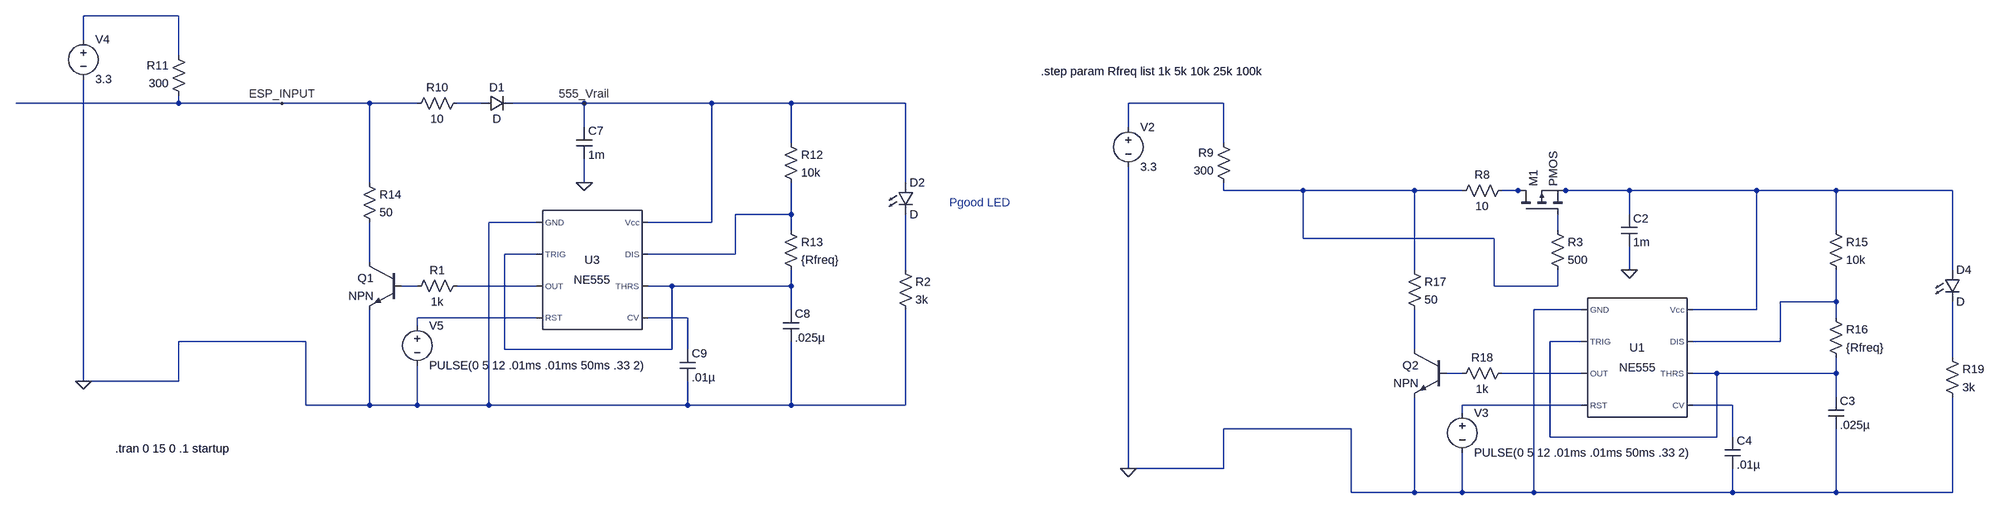
[diagram p0: schematic 2 Wire Communication.asc]
2 Wire Communication.asc, the LTspice schematic file:
Version 4
SHEET 1 3764 680
WIRE -2032 -400 -2224 -400
WIRE -2224 -352 -2224 -400
WIRE -2032 -320 -2032 -400
WIRE -2032 -224 -2032 -240
WIRE -2032 -224 -2608 -224
WIRE -1824 -224 -2032 -224
WIRE -1648 -224 -1824 -224
WIRE -1552 -224 -1648 -224
WIRE -1424 -224 -1472 -224
WIRE -1216 -224 -1360 -224
WIRE -960 -224 -1216 -224
WIRE -800 -224 -960 -224
WIRE -416 -224 -800 -224
WIRE 224 -224 32 -224
WIRE -1216 -176 -1216 -224
WIRE 32 -176 32 -224
WIRE -800 -144 -800 -224
WIRE 224 -144 224 -224
WIRE -1648 -64 -1648 -224
WIRE -1216 -64 -1216 -112
WIRE -416 -64 -416 -224
WIRE 224 -48 224 -64
WIRE 384 -48 224 -48
WIRE 608 -48 384 -48
WIRE 704 -48 608 -48
WIRE 816 -48 784 -48
WIRE 832 -48 816 -48
WIRE 912 -48 896 -48
WIRE 1040 -48 912 -48
WIRE 1296 -48 1040 -48
WIRE 1456 -48 1296 -48
WIRE 1840 -48 1456 -48
WIRE -800 0 -800 -64
WIRE -800 0 -912 0
WIRE 1040 0 1040 -48
WIRE -1312 16 -1408 16
WIRE -960 16 -960 -224
WIRE -960 16 -1088 16
WIRE -800 32 -800 0
WIRE 896 32 896 0
WIRE 1456 32 1456 -48
WIRE 384 48 384 -48
WIRE 768 48 384 48
WIRE -1312 80 -1376 80
WIRE -912 80 -912 0
WIRE -912 80 -1088 80
WIRE -1648 96 -1648 16
WIRE -416 112 -416 0
WIRE 608 112 608 -48
WIRE 1040 112 1040 64
WIRE 1840 112 1840 -48
WIRE -1552 144 -1584 144
WIRE -1312 144 -1472 144
WIRE -1040 144 -1088 144
WIRE -800 144 -800 112
WIRE -800 144 -1040 144
WIRE 768 144 768 48
WIRE 896 144 896 112
WIRE 896 144 768 144
WIRE 1456 176 1456 112
WIRE 1456 176 1344 176
WIRE -800 192 -800 144
WIRE 944 192 848 192
WIRE 1296 192 1296 -48
WIRE 1296 192 1168 192
WIRE -1312 208 -1552 208
WIRE -1008 208 -1088 208
WIRE 1456 208 1456 176
WIRE -1552 224 -1552 208
WIRE -1776 256 -2032 256
WIRE 944 256 880 256
WIRE 1344 256 1344 176
WIRE 1344 256 1168 256
WIRE -1376 272 -1376 80
WIRE -1040 272 -1040 144
WIRE -1040 272 -1376 272
WIRE -1008 272 -1008 208
WIRE 608 272 608 192
WIRE 1840 288 1840 176
WIRE 704 320 672 320
WIRE 944 320 784 320
WIRE 1216 320 1168 320
WIRE 1456 320 1456 288
WIRE 1456 320 1216 320
WIRE -2224 336 -2224 -272
WIRE -2032 336 -2032 256
WIRE -2032 336 -2224 336
WIRE 1456 368 1456 320
WIRE -1776 384 -1776 256
WIRE -1648 384 -1648 192
WIRE -1648 384 -1776 384
WIRE -1552 384 -1552 304
WIRE -1552 384 -1648 384
WIRE -1408 384 -1408 16
WIRE -1408 384 -1552 384
WIRE -1008 384 -1008 336
WIRE -1008 384 -1408 384
WIRE -800 384 -800 256
WIRE -800 384 -1008 384
WIRE -416 384 -416 192
WIRE -416 384 -800 384
WIRE 944 384 704 384
WIRE 1248 384 1168 384
WIRE 704 400 704 384
WIRE 480 432 224 432
WIRE 880 448 880 256
WIRE 1216 448 1216 320
WIRE 1216 448 880 448
WIRE 1248 448 1248 384
WIRE 32 512 32 -96
WIRE 224 512 224 432
WIRE 224 512 32 512
WIRE 480 560 480 432
WIRE 608 560 608 368
WIRE 608 560 480 560
WIRE 704 560 704 480
WIRE 704 560 608 560
WIRE 848 560 848 192
WIRE 848 560 704 560
WIRE 1248 560 1248 512
WIRE 1248 560 848 560
WIRE 1456 560 1456 432
WIRE 1456 560 1248 560
WIRE 1840 560 1840 368
WIRE 1840 560 1456 560
FLAG -2224 336 0
FLAG -1216 -64 0
FLAG -1824 -224 ESP_INPUT
FLAG -1216 -224 555_Vrail
FLAG 32 512 0
FLAG 1040 112 0
SYMBOL Misc\\NE555 -1200 112 R0
SYMATTR InstName U3
SYMBOL cap -1232 -176 R0
SYMATTR InstName C7
SYMATTR Value 1m
SYMBOL res -1456 -240 R90
WINDOW 0 0 56 VBottom 2
WINDOW 3 32 56 VTop 2
SYMATTR InstName R10
SYMATTR Value 10
SYMBOL res -2016 -224 R180
WINDOW 0 36 76 Left 2
WINDOW 3 36 40 Left 2
SYMATTR InstName R11
SYMATTR Value 300
SYMBOL voltage -2224 -368 R0
WINDOW 123 0 0 Left 0
WINDOW 39 0 0 Left 0
SYMATTR InstName V4
SYMATTR Value 3.3
SYMBOL res -816 -160 R0
SYMATTR InstName R12
SYMATTR Value 10k
SYMBOL cap -816 192 R0
SYMATTR InstName C8
SYMATTR Value .025µ
SYMBOL cap -1024 272 R0
SYMATTR InstName C9
SYMATTR Value .01µ
SYMBOL res -816 16 R0
SYMATTR InstName R13
SYMATTR Value {Rfreq}
SYMBOL res -1664 -80 R0
SYMATTR InstName R14
SYMATTR Value 50
SYMBOL voltage -1552 208 R0
WINDOW 123 0 0 Left 0
WINDOW 39 0 0 Left 0
SYMATTR InstName V5
SYMATTR Value PULSE(0 5 12 .01ms .01ms 50ms .33 2)
SYMBOL npn -1584 96 M0
SYMATTR InstName Q1
SYMBOL diode -1424 -208 R270
WINDOW 0 32 32 VTop 2
WINDOW 3 0 32 VBottom 2
SYMATTR InstName D1
SYMBOL res -1456 128 R90
WINDOW 0 0 56 VBottom 2
WINDOW 3 32 56 VTop 2
SYMATTR InstName R1
SYMATTR Value 1k
SYMBOL LED -432 -64 R0
SYMATTR InstName D2
SYMBOL res -432 96 R0
SYMATTR InstName R2
SYMATTR Value 3k
SYMBOL Misc\\NE555 1056 288 R0
SYMATTR InstName U1
SYMBOL cap 1024 0 R0
SYMATTR InstName C2
SYMATTR Value 1m
SYMBOL res 800 -64 R90
WINDOW 0 0 56 VBottom 2
WINDOW 3 32 56 VTop 2
SYMATTR InstName R8
SYMATTR Value 10
SYMBOL res 240 -48 R180
WINDOW 0 36 76 Left 2
WINDOW 3 36 40 Left 2
SYMATTR InstName R9
SYMATTR Value 300
SYMBOL voltage 32 -192 R0
WINDOW 123 0 0 Left 0
WINDOW 39 0 0 Left 0
SYMATTR InstName V2
SYMATTR Value 3.3
SYMBOL res 1440 16 R0
SYMATTR InstName R15
SYMATTR Value 10k
SYMBOL cap 1440 368 R0
SYMATTR InstName C3
SYMATTR Value .025µ
SYMBOL cap 1232 448 R0
SYMATTR InstName C4
SYMATTR Value .01µ
SYMBOL res 1440 192 R0
SYMATTR InstName R16
SYMATTR Value {Rfreq}
SYMBOL res 592 96 R0
SYMATTR InstName R17
SYMATTR Value 50
SYMBOL voltage 704 384 R0
WINDOW 123 0 0 Left 0
WINDOW 39 0 0 Left 0
SYMATTR InstName V3
SYMATTR Value PULSE(0 5 12 .01ms .01ms 50ms .33 2)
SYMBOL npn 672 272 M0
SYMATTR InstName Q2
SYMBOL res 800 304 R90
WINDOW 0 0 56 VBottom 2
WINDOW 3 32 56 VTop 2
SYMATTR InstName R18
SYMATTR Value 1k
SYMBOL LED 1824 112 R0
SYMATTR InstName D4
SYMBOL res 1824 272 R0
SYMATTR InstName R19
SYMATTR Value 3k
SYMBOL pmos 816 0 R270
SYMATTR InstName M1
SYMBOL res 880 16 R0
SYMATTR InstName R3
SYMATTR Value 500
TEXT -2160 472 Left 2 !.tran 0 15 0 .1 startup
TEXT -328 -24 Left 2 ;Pgood LED
TEXT -144 -288 Left 2 !.step param Rfreq list 1k 5k 10k 25k 100k

The netlist it stands for:
* 2 Wire Communication.asc
XU3 0 N009 N013 N015 N016 N009 N007 555_Vrail NE555  ; pins GND TRIG OUT RST CV THRS DIS Vcc
C7 555_Vrail 0 1m
R10 N002 ESP_INPUT 10
R11 ESP_INPUT N001 300
V4 N001 0 3.3
R12 555_Vrail N007 10k
C8 N009 0 .025µ
C9 N016 0 .01µ
R13 N007 N009 {Rfreq}
R14 ESP_INPUT N010 50
V5 N015 0 PULSE(0 5 12 .01ms .01ms 50ms .33 2)
Q1 N010 N012 0 0 NPN
D1 N002 555_Vrail D
R1 N013 N012 1k
D2 555_Vrail N011 D
R2 N011 0 3k
XU1 0 N017 N021 N022 N023 N017 N014 N006 NE555  ; pins GND TRIG OUT RST CV THRS DIS Vcc
C2 N006 0 1m
R8 N005 N004 10
R9 N004 N003 300
V2 N003 0 3.3
R15 N006 N014 10k
C3 N017 0 .025µ
C4 N023 0 .01µ
R16 N014 N017 {Rfreq}
R17 N004 N018 50
V3 N022 0 PULSE(0 5 12 .01ms .01ms 50ms .33 2)
Q2 N018 N020 0 0 NPN
R18 N021 N020 1k
D4 N006 N019 D
R19 N019 0 3k
M1 N005 N008 N006 N006 PMOS
R3 N008 N004 500
.model D D
.lib standard.dio
.model NPN NPN
.model PNP PNP
.lib standard.bjt
.model NMOS NMOS
.model PMOS PMOS
.lib standard.mos
.tran 0 15 0 .1 startup
* Pgood LED
.step param Rfreq list 1k 5k 10k 25k 100k
.lib NE555.sub
.backanno
.end